# Altium schematic sheet MCU.SchDoc
size A4
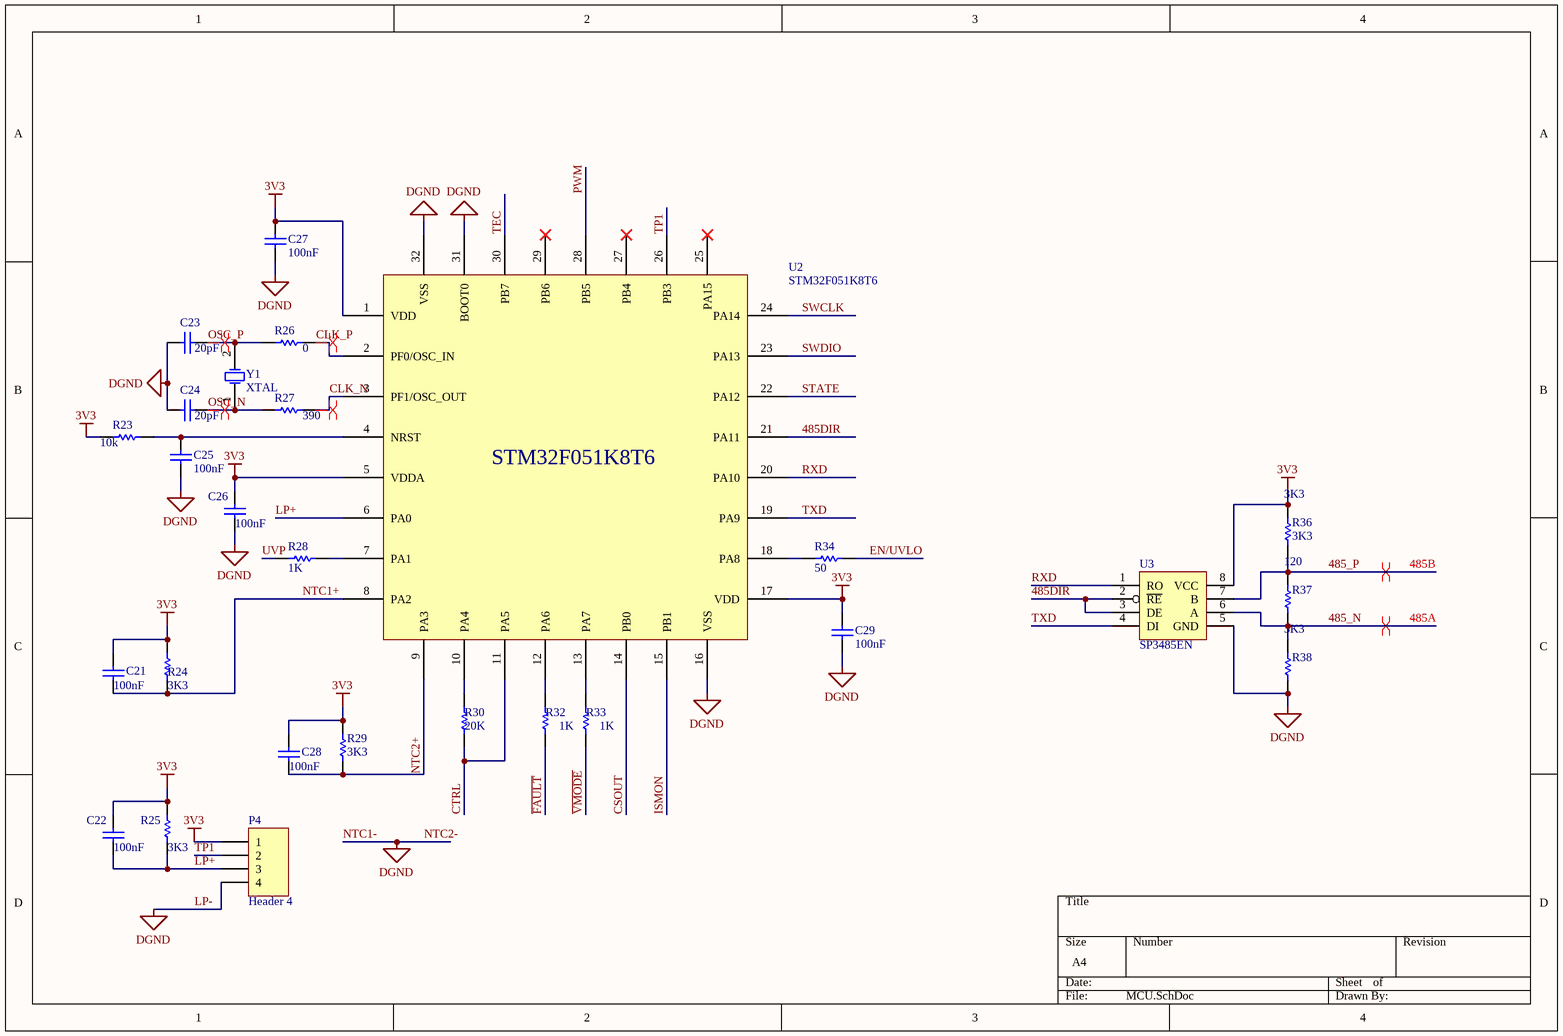
[diagram p0: MCU.SchDoc]

## Parts
C21  100nF  [1608[0603]]
C22  100nF  [1608[0603]]
C23  20pF  [1608[0603]]
C24  20pF  [1608[0603]]
C25  100nF  [1608[0603]]
C26  100nF  [1608[0603]]
C27  100nF  [1608[0603]]
C28  100nF  [1608[0603]]
C29  100nF  [1608[0603]]
P4  Header 4  [HDR1X4]
R23  10k  [1608[0603]]
R24  3K3  [1608[0603]]
R25  3K3  [1608[0603]]
R26  0  [1608[0603]]
R27  390  [1608[0603]]
R28  1K  [1608[0603]]
R29  3K3  [1608[0603]]
R30  20K  [1608[0603]]
R32  1K  [1608[0603]]
R33  1K  [1608[0603]]
R34  50  [1608[0603]]
R36  3K3  [1608[0603]]
R37  120  [1608[0603]]
R38  3K3  [1608[0603]]
U2  STM32F051K8T6  [TQFP80P900X900X160-32N]
U3  SP3485EN  [SOIC127P600-8N]
Y1  XTAL  [XTAL_SMT]

## Nets
3V3: C21.1 C22.1 C26.1 C27.2 C28.1 C29.2 P4.1 R23.2 R24.1 R25.1 R29.1 R36.2 U2.1(VDD) U2.5(VDDA) U2.17(VDD) U3.8(VCC)
LP-: C23.2 C24.2 C25.1 C26.2 C27.1 C29.1 P4.4 R38.1 U2.16(VSS) U2.31(BOOT0) U2.32(VSS) U3.5(GND)  [also labelled DGND, NTC1-, NTC2-]
485_N: R37.1 R38.2 U3.6(A)  [also labelled 485A]
485_P: R36.1 R37.2 U3.7(B)  [also labelled 485B]
485DIR: U2.21(PA11) U3.2(~{RE}) U3.3(DE)
CLK_N: R27.2 U2.3(PF1/OSC_OUT)
CLK_P: R26.2 U2.2(PF0/OSC_IN)
CSOUT: U2.14(PB0)
CTRL: R30.2 U2.11(PA5)
EN/UVLO: R34.2
~{FAULT}: R32.2
ISMON: U2.15(PB1)
LP+: C22.2 P4.3 R25.2 U2.6(PA0)
NTC1+: C21.2 R24.2 U2.8(PA2)
NTC2+: C28.2 R29.2 U2.9(PA3)
OSC_N: C24.1 R27.1 Y1.1(OSC1)
OSC_P: C23.1 R26.1 Y1.2(OSC2)
PWM: U2.28(PB5)
RXD: U2.20(PA10) U3.1(RO)
STATE: U2.22(PA12)
SWCLK: U2.24(PA14)
SWDIO: U2.23(PA13)
TEC: U2.30(PB7)
TP1: P4.2 U2.26(PB3)
TXD: U2.19(PA9) U3.4(DI)
UVP: R28.1
~{VMODE}: R33.2
NetC25_2: C25.2 R23.1 U2.4(NRST)
NetR28_2: R28.2 U2.7(PA1)
NetR30_1: R30.1 U2.10(PA4)
NetR32_1: R32.1 U2.12(PA6)
NetR33_1: R33.1 U2.13(PA7)
NetR34_1: R34.1 U2.18(PA8)

Not connected (* = marked no-connect by the designer): U2 25(PA15)* 27(PB4)* 29(PB6)*

## Layout directives
differential pair: 485_N, 485_P, CLK_N, CLK_P, OSC_N, OSC_P

## Library data of the parts
C21-C29 = Cap: Capacitor; Published: 8-Jun-2000; LatestRevisionDate: 17-Jul-2002; LatestRevisionNote: Re-released for DXP Platform.; PackageReference: RAD-0.3; Publisher: Altium Limited; PackageDescription: Radial Cap, Thru-Hole; 2 Leads; 0.3 in Pin Spacing
  C21 C22 C25-C29: Value: 100nF
  C23 C24: Value: 20pF
P4 = Header 4: Header, 4-Pin; LatestRevisionDate: 17-Jul-2002; LatestRevisionNote: Re-released for DXP Platform.; Publisher: Altium Limited
R23-R30 R32-R34 R36-R38 = Res1: Resistor; Published: 8-Jun-2000; LatestRevisionDate: 17-Jul-2002; LatestRevisionNote: Re-released for DXP Platform.; PackageReference: AXIAL-0.3; Publisher: Altium Limited; PackageDescription: Axial Device, Thru-Hole; 2 Leads; 0.3 in Pin Spacing
  R23: Value: 10K
  R24 R25 R29 R36 R38: Value: 3K3
  R26: Value: 0
  R27: Value: 390
  R28 R32 R33: Value: 1k
  R30: Value: 20K
  R34: Value: 50
  R37: Value: 120
U2 = MCU_STM32F051K8T6: Low- and medium-density advanced ARM?-based 32-bit MCU with  16 to 64 Kbytes Flash, timers, ADC, DAC and comm. interfaces
U3 = LGC_RS485: Low-Power, Slew-Rate-Limited  RS-485/RS-422 Transceivers
Y1 = XTAL: Crystal Oscillator; Published: 8-Jun-2000; LatestRevisionDate: 17-Jul-2002; LatestRevisionNote: Re-released for DXP Platform.; PackageReference: R38; Publisher: Altium Limited; PackageDescription: Crystal, Thru-Hole; 2 Leads; Body 3.1 x 8.2 mm (Dia.xH)